# Altium schematic sheet TSSP.SchDoc
size 400 x 299 mm; SheetNumber: 1; SheetTotal: 1
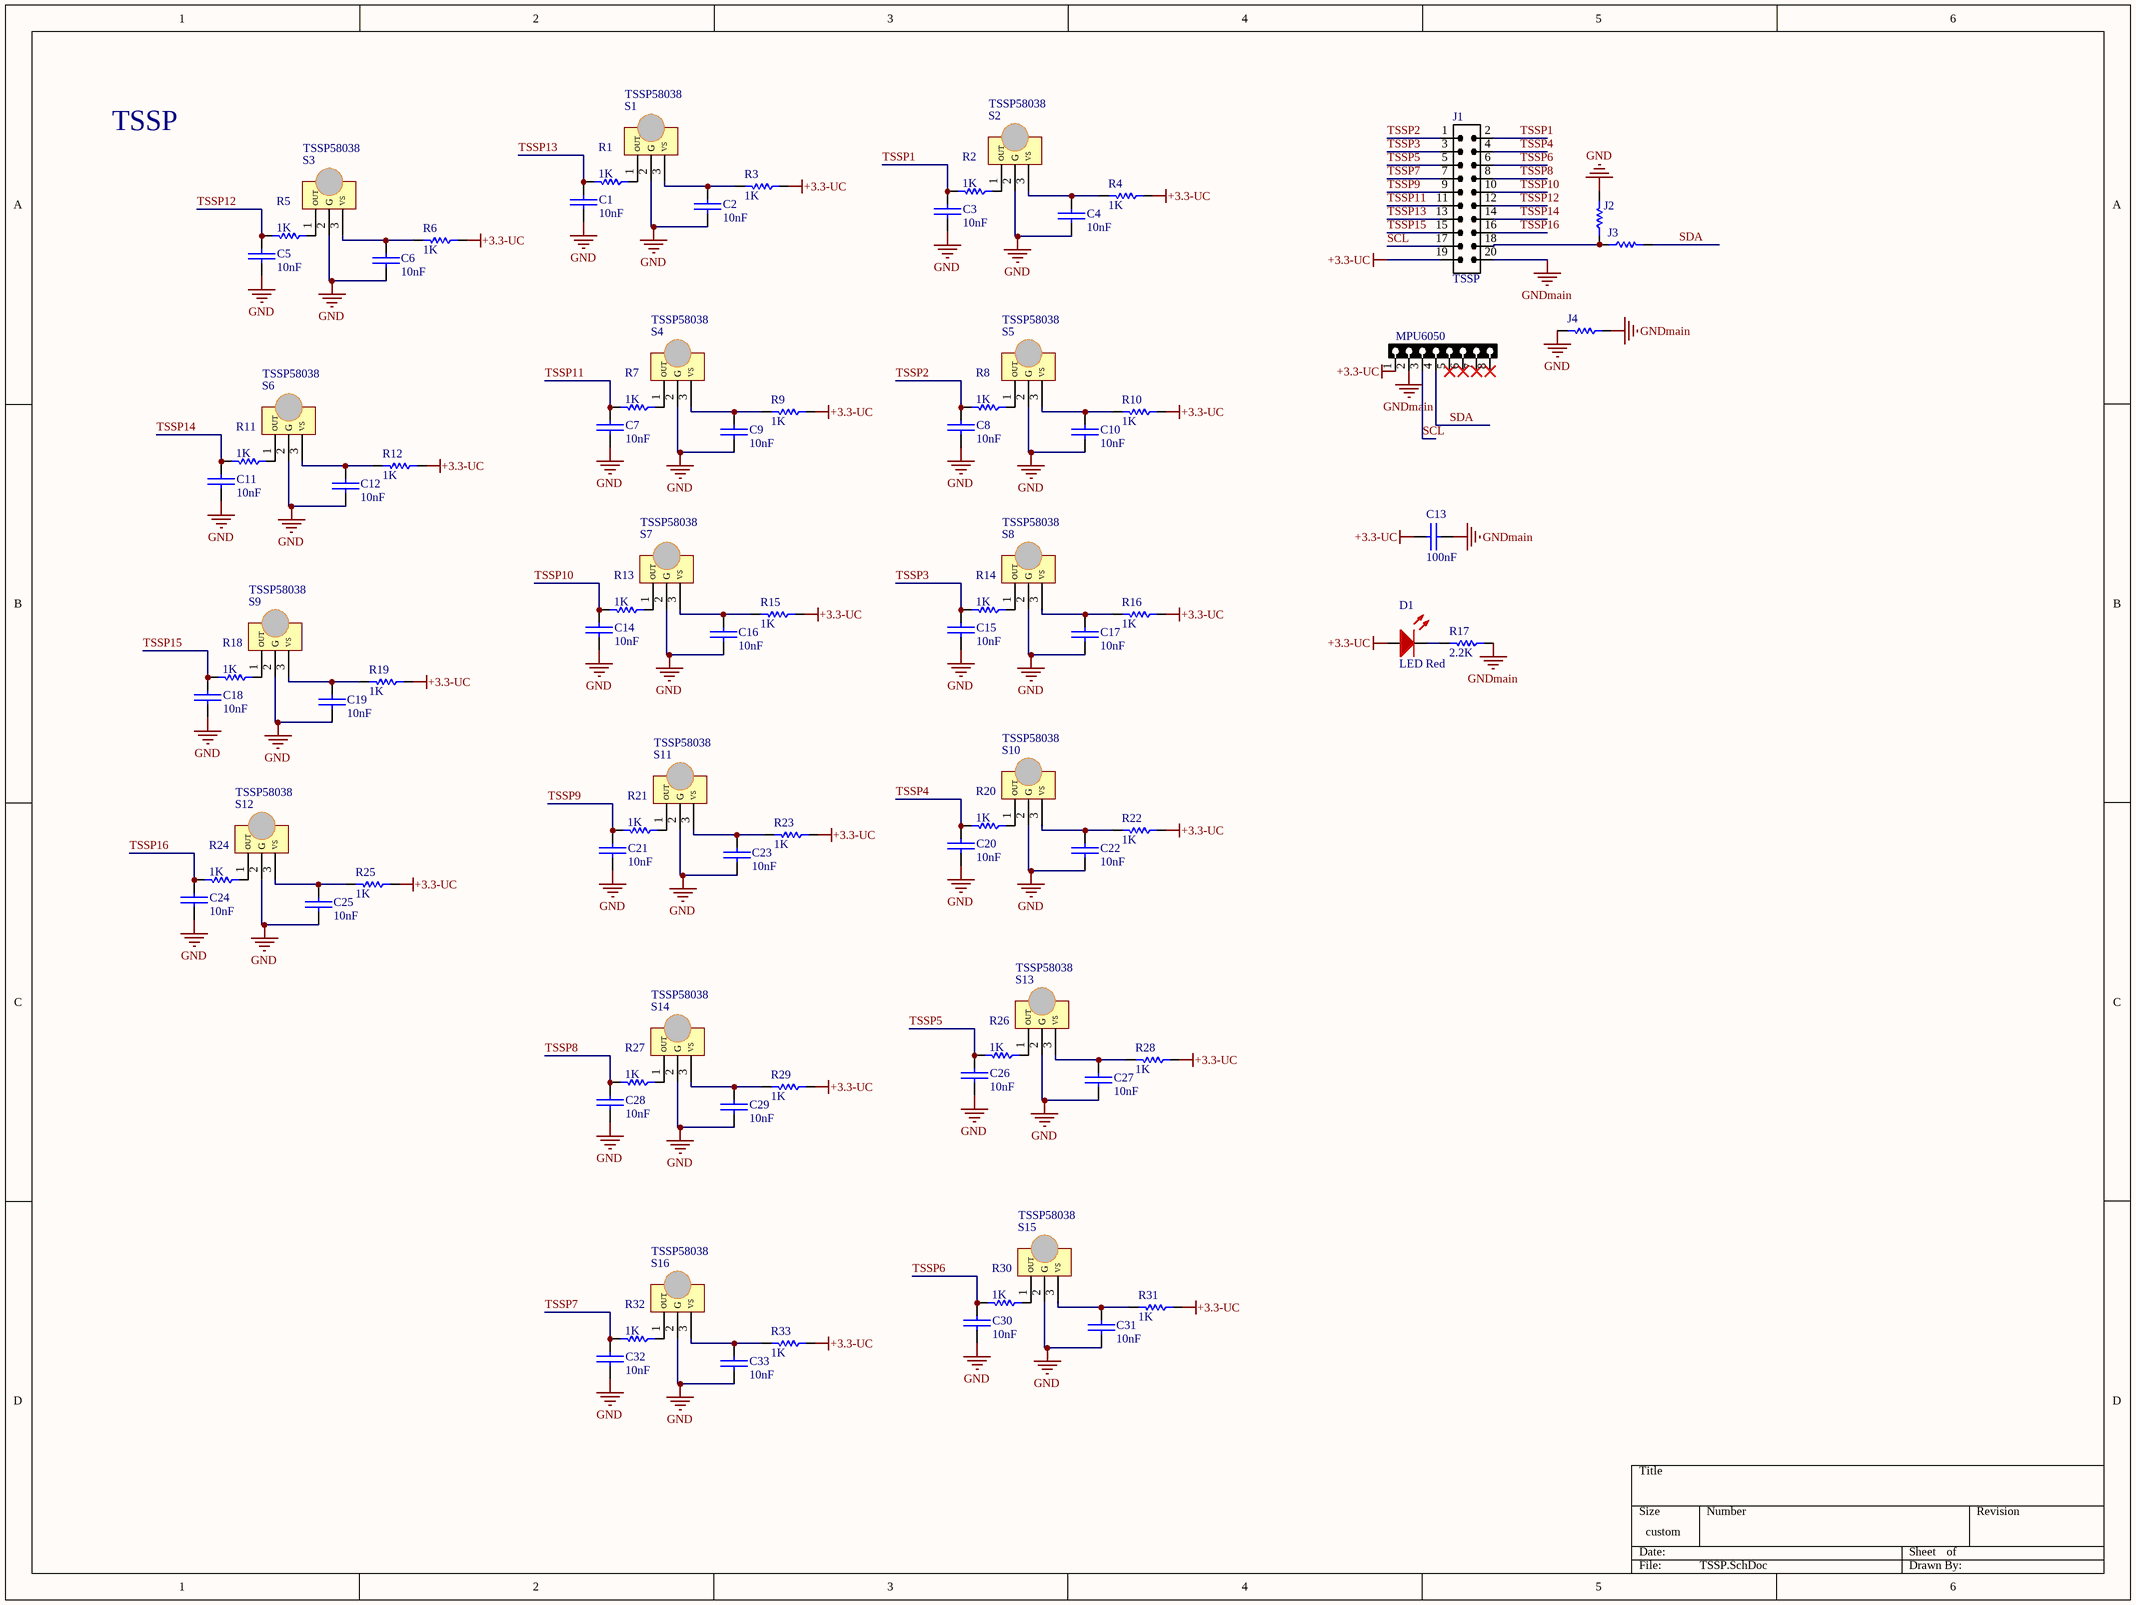
[diagram p0: TSSP.SchDoc]

## Parts
C1  10nF  [C0603]
C2  10nF  [C0603]
C3  10nF  [C0603]
C4  10nF  [C0603]
C5  10nF  [C0603]
C6  10nF  [C0603]
C7  10nF  [C0603]
C8  10nF  [C0603]
C9  10nF  [C0603]
C10  10nF  [C0603]
C11  10nF  [C0603]
C12  10nF  [C0603]
C13  100nF  [SMD_CAP_0805]
C14  10nF  [C0603]
C15  10nF  [C0603]
C16  10nF  [C0603]
C17  10nF  [C0603]
C18  10nF  [C0603]
C19  10nF  [C0603]
C20  10nF  [C0603]
C21  10nF  [C0603]
C22  10nF  [C0603]
C23  10nF  [C0603]
C24  10nF  [C0603]
C25  10nF  [C0603]
C26  10nF  [C0603]
C27  10nF  [C0603]
C28  10nF  [C0603]
C29  10nF  [C0603]
C30  10nF  [C0603]
C31  10nF  [C0603]
C32  10nF  [C0603]
C33  10nF  [C0603]
D1  LED Red  [LED_Red_1206]
J1  TSSP  [IDC_2X10]
J2  (no value)  [RES 0805 (2012X06L)]
J3  (no value)  [RES 0805 (2012X06L)]
J4  (no value)  [RES 0805 (2012X06L)]
MPU6050  HDRF8  [HDR_F_1X8]  (value not drawn)
R1  1K  [RES 0603 (1608X06L)]
R2  1K  [RES 0603 (1608X06L)]
R3  1K  [RES 0603 (1608X06L)]
R4  1K  [RES 0603 (1608X06L)]
R5  1K  [RES 0603 (1608X06L)]
R6  1K  [RES 0603 (1608X06L)]
R7  1K  [RES 0603 (1608X06L)]
R8  1K  [RES 0603 (1608X06L)]
R9  1K  [RES 0603 (1608X06L)]
R10  1K  [RES 0603 (1608X06L)]
R11  1K  [RES 0603 (1608X06L)]
R12  1K  [RES 0603 (1608X06L)]
R13  1K  [RES 0603 (1608X06L)]
R14  1K  [RES 0603 (1608X06L)]
R15  1K  [RES 0603 (1608X06L)]
R16  1K  [RES 0603 (1608X06L)]
R17  2.2K  [RES 0805 (2012X06L)]
R18  1K  [RES 0603 (1608X06L)]
R19  1K  [RES 0603 (1608X06L)]
R20  1K  [RES 0603 (1608X06L)]
R21  1K  [RES 0603 (1608X06L)]
R22  1K  [RES 0603 (1608X06L)]
R23  1K  [RES 0603 (1608X06L)]
R24  1K  [RES 0603 (1608X06L)]
R25  1K  [RES 0603 (1608X06L)]
R26  1K  [RES 0603 (1608X06L)]
R27  1K  [RES 0603 (1608X06L)]
R28  1K  [RES 0603 (1608X06L)]
R29  1K  [RES 0603 (1608X06L)]
R30  1K  [RES 0603 (1608X06L)]
R31  1K  [RES 0603 (1608X06L)]
R32  1K  [RES 0603 (1608X06L)]
R33  1K  [RES 0603 (1608X06L)]
S1  TSSP58038  [TSSP58038]
S2  TSSP58038  [TSSP58038]
S3  TSSP58038  [TSSP58038]
S4  TSSP58038  [TSSP58038]
S5  TSSP58038  [TSSP58038]
S6  TSSP58038  [TSSP58038]
S7  TSSP58038  [TSSP58038]
S8  TSSP58038  [TSSP58038]
S9  TSSP58038  [TSSP58038]
S10  TSSP58038  [TSSP58038]
S11  TSSP58038  [TSSP58038]
S12  TSSP58038  [TSSP58038]
S13  TSSP58038  [TSSP58038]
S14  TSSP58038  [TSSP58038]
S15  TSSP58038  [TSSP58038]
S16  TSSP58038  [TSSP58038]

## Nets
+3.3-UC: C13.1(+) D1.1(A) J1.19 MPU6050.1 R3.1 R4.1 R6.1 R9.1 R10.1 R12.1 R15.1 R16.1 R19.1 R22.1 R23.1 R25.1 R28.1 R29.1 R31.1 R33.1
GND: C1.2(-) C2.2(-) C3.2(-) C4.2(-) C5.2(-) C6.2(-) C7.2(-) C8.2(-) C9.2(-) C10.2(-) C11.2(-) C12.2(-) C14.2(-) C15.2(-) C16.2(-) C17.2(-) C18.2(-) C19.2(-) C20.2(-) C21.2(-) C22.2(-) C23.2(-) C24.2(-) C25.2(-) C26.2(-) C27.2(-) C28.2(-) C29.2(-) C30.2(-) C31.2(-) C32.2(-) C33.2(-) J2.2 J4.2 S1.2(G) S2.2(G) S3.2(G) S4.2(G) S5.2(G) S6.2(G) S7.2(G) S8.2(G) S9.2(G) S10.2(G) S11.2(G) S12.2(G) S13.2(G) S14.2(G) S15.2(G) S16.2(G)
GNDmain: C13.2(-) J1.20 J4.1 MPU6050.2 R17.1
SCL: J1.17 MPU6050.3
SDA: J3.2 MPU6050.4
TSSP1: C3.1(+) J1.2 R2.2
TSSP2: C8.1(+) J1.1 R8.2
TSSP3: C15.1(+) J1.3 R14.2
TSSP4: C20.1(+) J1.4 R20.2
TSSP5: C26.1(+) J1.5 R26.2
TSSP6: C30.1(+) J1.6 R30.2
TSSP7: C32.1(+) J1.7 R32.2
TSSP8: C28.1(+) J1.8 R27.2
TSSP9: C21.1(+) J1.9 R21.2
TSSP10: C14.1(+) J1.10 R13.2
TSSP11: C7.1(+) J1.11 R7.2
TSSP12: C5.1(+) J1.12 R5.2
TSSP13: C1.1(+) J1.13 R1.2
TSSP14: C11.1(+) J1.14 R11.2
TSSP15: C18.1(+) J1.15 R18.2
TSSP16: C24.1(+) J1.16 R24.2
NetC2_1: C2.1(+) R3.2 S1.3(VS)
NetC4_1: C4.1(+) R4.2 S2.3(VS)
NetC6_1: C6.1(+) R6.2 S3.3(VS)
NetC9_1: C9.1(+) R9.2 S4.3(VS)
NetC10_1: C10.1(+) R10.2 S5.3(VS)
NetC12_1: C12.1(+) R12.2 S6.3(VS)
NetC16_1: C16.1(+) R15.2 S7.3(VS)
NetC17_1: C17.1(+) R16.2 S8.3(VS)
NetC19_1: C19.1(+) R19.2 S9.3(VS)
NetC22_1: C22.1(+) R22.2 S10.3(VS)
NetC23_1: C23.1(+) R23.2 S11.3(VS)
NetC25_1: C25.1(+) R25.2 S12.3(VS)
NetC27_1: C27.1(+) R28.2 S13.3(VS)
NetC29_1: C29.1(+) R29.2 S14.3(VS)
NetC31_1: C31.1(+) R31.2 S15.3(VS)
NetC33_1: C33.1(+) R33.2 S16.3(VS)
NetD1_2: D1.2(K) R17.2
NetJ1_18: J1.18 J2.1 J3.1
NetR1_1: R1.1 S1.1(OUT)
NetR2_1: R2.1 S2.1(OUT)
NetR5_1: R5.1 S3.1(OUT)
NetR7_1: R7.1 S4.1(OUT)
NetR8_1: R8.1 S5.1(OUT)
NetR11_1: R11.1 S6.1(OUT)
NetR13_1: R13.1 S7.1(OUT)
NetR14_1: R14.1 S8.1(OUT)
NetR18_1: R18.1 S9.1(OUT)
NetR20_1: R20.1 S10.1(OUT)
NetR21_1: R21.1 S11.1(OUT)
NetR24_1: R24.1 S12.1(OUT)
NetR26_1: R26.1 S13.1(OUT)
NetR27_1: R27.1 S14.1(OUT)
NetR30_1: R30.1 S15.1(OUT)
NetR32_1: R32.1 S16.1(OUT)

Not connected (* = marked no-connect by the designer): MPU6050 5* 6* 7* 8*

## Notes on the sheet
- TSSP

## Library data of the parts
C1-C33 = Cap-Bipolar: Bipolar Capacitor; Voltage: 100V; Designer: Saeid Jorablo; Organazation: ControTec; Adding Date: 1387/12/20
  C1-C12 C14-C33: Value: 10nF
  C13: Value: 100nF
J1 = IDC_2X10: CONN, IDC, Male, pitch: 2.54mm, 20POS; VALUE: IDC_2X10
J2-J4 R1-R33 = Resistor
  R1-R16 R18-R33: Value: 1K
  R17: Value: 2.2K
MPU6050 = HDR_F_1X8: CONN, HEADER, Female, pitch: 2.54mm, 8POS; VALUE: HDRF8